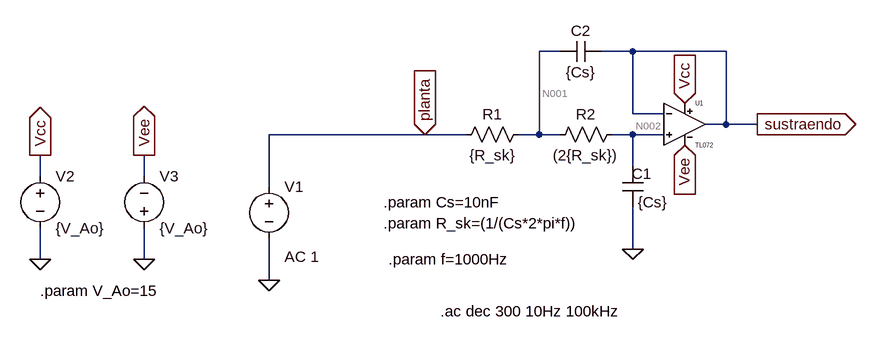
[diagram p0: schematic planta_sk.asc]
planta_sk.asc, the LTspice schematic file:
Version 4
SHEET 1 880 680
WIRE 176 -16 144 -16
WIRE 288 -16 240 -16
WIRE 432 -16 288 -16
WIRE 288 80 288 -16
WIRE 336 80 288 80
WIRE 432 96 432 -16
WIRE 432 96 400 96
WIRE 480 96 432 96
WIRE -32 112 -272 112
WIRE 32 112 -32 112
WIRE 144 112 144 -16
WIRE 144 112 112 112
WIRE 176 112 144 112
WIRE 288 112 256 112
WIRE 336 112 288 112
WIRE 288 160 288 112
WIRE -624 176 -624 144
WIRE -464 176 -464 144
WIRE -272 192 -272 112
WIRE 288 288 288 224
WIRE -624 304 -624 256
WIRE -464 304 -464 256
WIRE -272 336 -272 272
FLAG 368 64 Vcc
IOPIN 368 64 In
FLAG 368 128 Vee
IOPIN 368 128 In
FLAG 288 288 0
FLAG 480 96 sustraendo
IOPIN 480 96 Out
FLAG -32 112 planta
IOPIN -32 112 In
FLAG -272 336 0
FLAG -624 304 0
FLAG -464 304 0
FLAG -464 144 Vee
IOPIN -464 144 Out
FLAG -624 144 Vcc
IOPIN -624 144 Out
SYMBOL res 128 96 R90
WINDOW 0 0 56 VBottom 2
WINDOW 3 32 56 VTop 2
SYMATTR InstName R1
SYMATTR Value {R_sk}
SYMBOL res 272 96 R90
WINDOW 0 0 56 VBottom 2
WINDOW 3 32 56 VTop 2
SYMATTR InstName R2
SYMATTR Value (2{R_sk})
SYMBOL cap 272 160 R0
WINDOW 0 15 12 Left 2
SYMATTR InstName C1
SYMATTR Value {Cs}
SYMBOL Opamps\\TL072 368 32 R0
SYMATTR InstName U1
SYMBOL cap 240 -32 R90
WINDOW 0 0 32 VBottom 2
WINDOW 3 32 32 VTop 2
SYMATTR InstName C2
SYMATTR Value {Cs}
SYMBOL voltage -272 176 R0
WINDOW 123 24 124 Left 2
WINDOW 39 0 0 Left 0
SYMATTR Value2 AC 1
SYMATTR InstName V1
SYMATTR Value ""
SYMBOL voltage -624 160 R0
SYMATTR InstName V2
SYMATTR Value {V_Ao}
SYMBOL voltage -464 272 M180
WINDOW 0 24 96 Left 2
WINDOW 3 24 16 Left 2
SYMATTR InstName V3
SYMATTR Value {V_Ao}
TEXT -96 216 Left 2 !.param Cs=10nF
TEXT -96 248 Left 2 !.param R_sk=(1/(Cs*2*pi*f))
TEXT -88 304 Left 2 !.param f=1000Hz
TEXT -8 384 Left 2 !.ac dec 300 10Hz 100kHz
TEXT -624 352 Left 2 !.param V_Ao=15

The netlist it stands for:
* planta_sk.asc
R1 N001 planta {R_sk}
R2 N002 N001 (2{R_sk})
C1 N002 0 {Cs}
XU1 N002 sustraendo Vcc Vee sustraendo TL072  ; pins In+ In- V+ V- OUT
C2 sustraendo N001 {Cs}
V1 planta 0 AC 1
V2 Vcc 0 {V_Ao}
V3 0 Vee {V_Ao}
.param Cs=10nF
.param R_sk=(1/(Cs*2*pi*f))
.param f=1000Hz
.ac dec 300 10Hz 100kHz
.param V_Ao=15
.lib TL072.sub
.backanno
.end

* Results of the author's LTspice run, read from the files saved beside the schematic
* Operating Point, zero values left out:
*   V(n001) = -717 nV
*   V(n002) = -1.434 µV
*   V(sustraendo) = 9.537 µV
*   V(vee) = -15 V
*   V(vcc) = 15 V
*   I(R2) = -45.05 pA
*   I(R1) = -45.05 pA
*   I(V3) = -14.19 mA
*   I(V2) = -14.19 mA
*   I(V1) = -45.05 pA
*   Ix(u1:1) = 45.05 pA
*   Ix(u1:2) = 45.05 pA
*   Ix(u1:3) = 14.19 mA
*   Ix(u1:4) = -14.19 mA
*   Ix(u1:5) = -45.05 pA
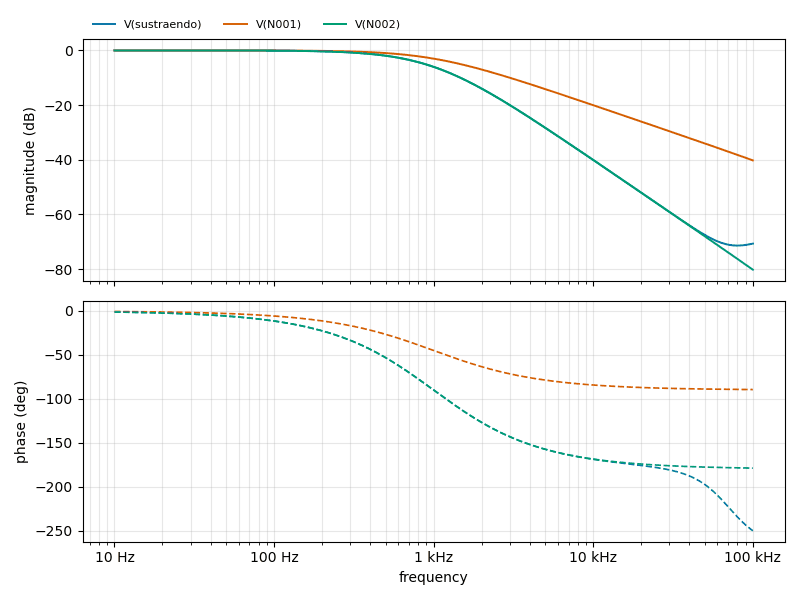
[diagram p1: AC Analysis of planta_sk.asc, plotted from the saved traces]
* AC Analysis, 1 run:
*   V(sustraendo): -0.00 dB at 10 Hz, -70.70 dB at 100 kHz, peak -0.00 dB at 10 Hz, 3 dB below the peak at 643.7 Hz
*   V(N001): -0.00 dB at 10 Hz, -40.24 dB at 100 kHz, peak -0.00 dB at 10 Hz, 3 dB below the peak at 1 kHz
*   V(N002): -0.00 dB at 10 Hz, -80.24 dB at 100 kHz, peak -0.00 dB at 10 Hz, 3 dB below the peak at 643.7 Hz